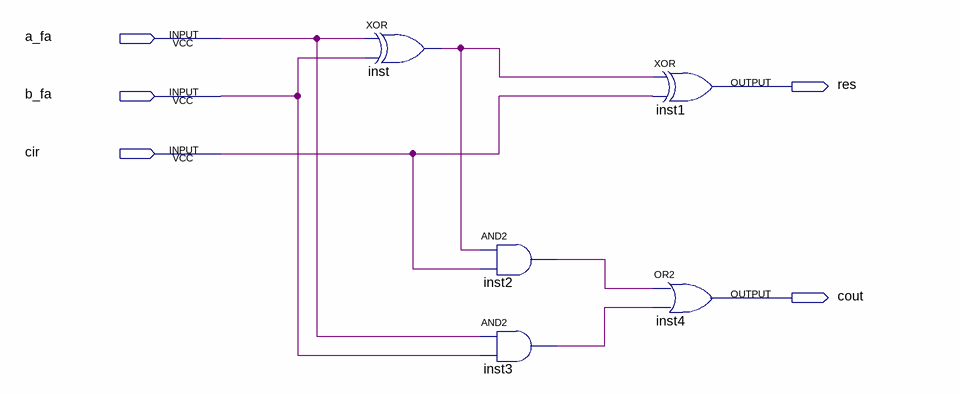
[diagram p0: schematic sheet]
// Quartus schematic 1-bit_adder.bdf as structural Verilog: 5 symbols, 5 pins
module \1-bit_adder  (
  input  a_fa,
  input  b_fa,
  input  cir,
  output res,
  output cout
);

  wire inst2_out, inst3_out, inst_out;

  xor inst (inst_out, a_fa, b_fa);
  and inst2 (inst2_out, inst_out, cir);
  and inst3 (inst3_out, a_fa, b_fa);
  xor inst1 (res, inst_out, cir);
  or inst4 (cout, inst2_out, inst3_out);
endmodule
